# Altium schematic sheet stm32.SchDoc
size A4
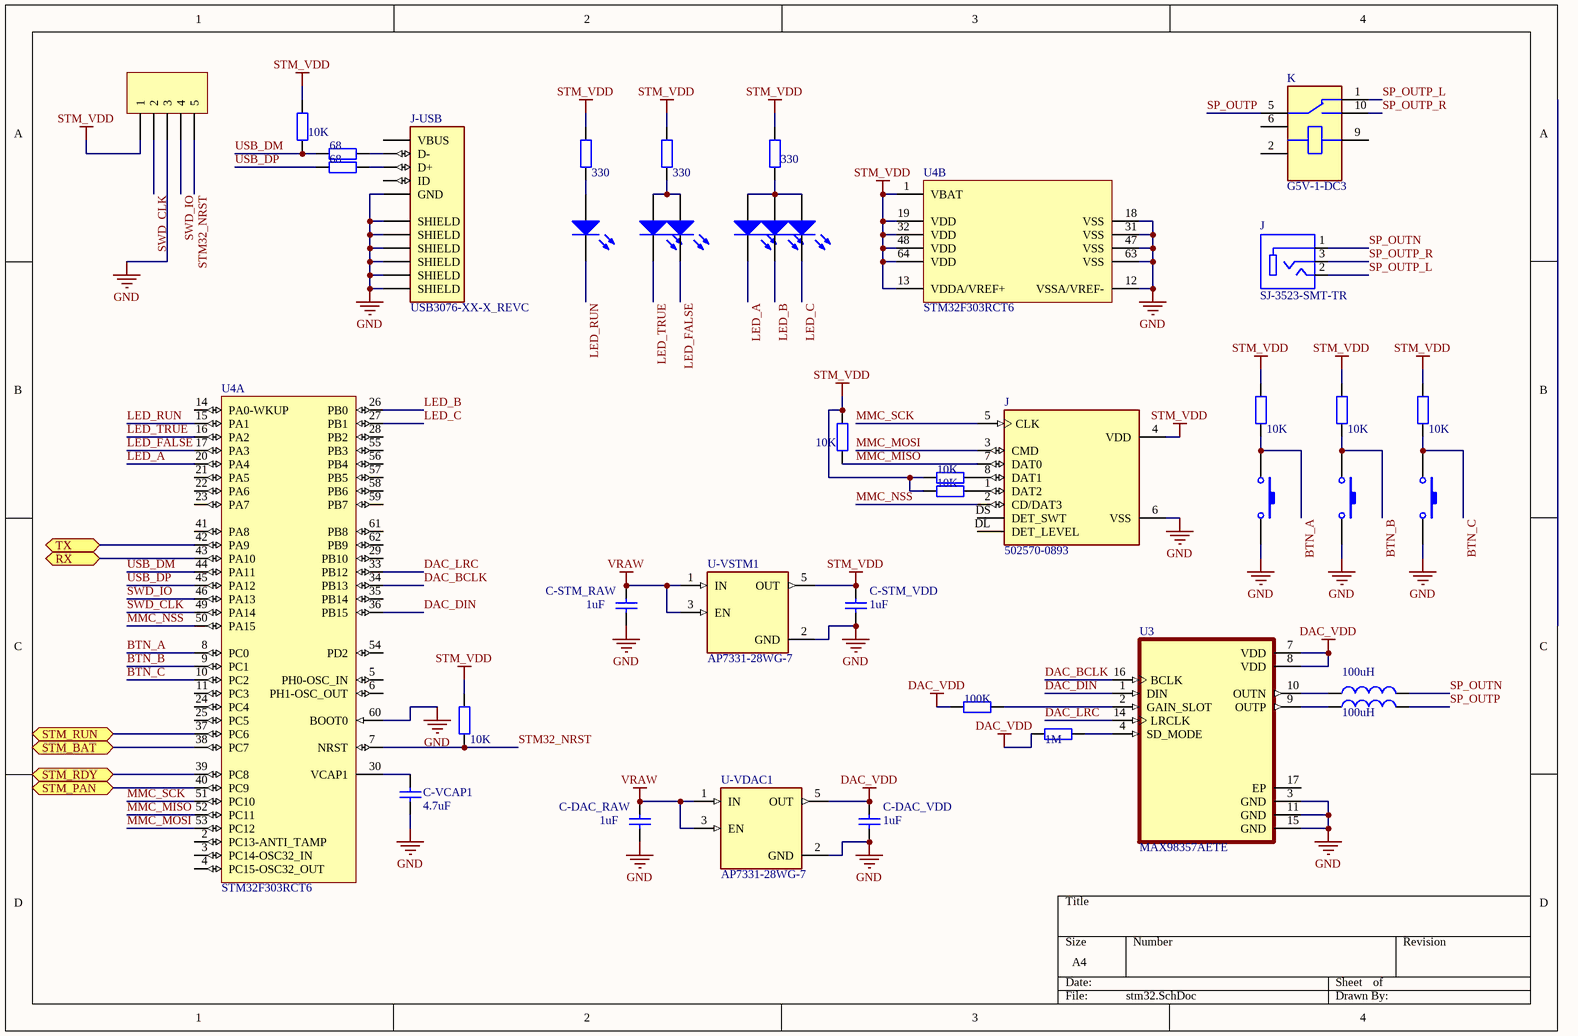
[diagram p0: stm32.SchDoc]

## Parts
(Parts that share a designator on the sheet are numbered #1, #2 ... from top to bottom, then left to right.)
C-DAC_RAW  value 1uF  [RAD-0.3]  (hidden comment: Cap)
C-DAC_VDD  value 1uF  [RAD-0.3]  (hidden comment: Cap)
C-STM_RAW  value 1uF  [RAD-0.3]  (hidden comment: Cap)
C-STM_VDD  value 1uF  [RAD-0.3]  (hidden comment: Cap)
C-VCAP1  value 4.7uF  [RAD-0.3]  (hidden comment: Cap)
D2  LED0  [LED-0]  (value not drawn)
D-BTN1  LED0  [LED-0]  (value not drawn)
D-BTN2  LED0  [LED-0]  (value not drawn)
D-BTN3  LED0  [LED-0]  (value not drawn)
D-LED-ANS1  LED0  [LED-0]  (value not drawn)
D-LED-ANS2  LED0  [LED-0]  (value not drawn)
J#1  SJ-3523-SMT-TR  [CUI_SJ-3523-SMT-TR]
J#2  502570-0893  [MOLEX_502570-0893]
J-USB  USB3076-XX-X_REVC  [GCT_USB3076-XX-X_REVC]
K  G5V-1-DC3  [RELAY_G5V-1-DC5]
L-DAC1  value 100uH  [0402-A]  (hidden comment: Inductor)
L-DAC2  value 100uH  [0402-A]  (hidden comment: Inductor)
P-STM32PROG  Header 5  [HDR1X5]  (value not drawn)
R-BTN1  value 10K  [AXIAL-0.4]  (hidden comment: Res2)
R-BTN2  value 10K  [AXIAL-0.4]  (hidden comment: Res2)
R-BTN3  value 10K  [AXIAL-0.4]  (hidden comment: Res2)
R-DAC1  value 100K  [AXIAL-0.4]  (hidden comment: Res2)
R-DAC3  value 1M  [AXIAL-0.4]  (hidden comment: Res2)
R-LED-ANS1  value 330  [AXIAL-0.4]  (hidden comment: Res2)
R-LED-BTN1  value 330  [AXIAL-0.4]  (hidden comment: Res2)
R-LED-RUN1  value 330  [AXIAL-0.4]  (hidden comment: Res2)
R-MMC1  value 10K  [AXIAL-0.4]  (hidden comment: Res2)
R-MMC2  value 10K  [AXIAL-0.4]  (hidden comment: Res2)
R-MMC3  value 10K  [AXIAL-0.4]  (hidden comment: Res2)
R-STM1  value 10K  [AXIAL-0.4]  (hidden comment: Res2)
R-USB1  value 10K  [AXIAL-0.4]  (hidden comment: Res2)
R-USB2  value 68  [AXIAL-0.4]  (hidden comment: Res2)
R-USB3  value 68  [AXIAL-0.4]  (hidden comment: Res2)
S-BTN1  SW-PB  [SPST-2]  (value not drawn)
S-BTN2  SW-PB  [SPST-2]  (value not drawn)
S-BTN3  SW-PB  [SPST-2]  (value not drawn)
U3  MAX98357AETE  [QFN50P300X300X80-17N]
U4  STM32F303RCT6  [STM-LQFP64_N]  (parts A,B of 2)
U-VDAC1  AP7331-28WG-7  [SOT95P285X145-5N]
U-VSTM1  AP7331-28WG-7  [SOT95P285X145-5N]

## Ports
RX, STM_BAT, STM_PAN, STM_RDY, STM_RUN, TX

## Nets
DAC_VDD: C-DAC_VDD.2 R-DAC1.1 R-DAC3.1 U3.7(VDD) U3.8(VDD) U-VDAC1.5(OUT)
GND: C-DAC_RAW.1 C-DAC_VDD.1 C-STM_RAW.1 C-STM_VDD.1 C-VCAP1.1 J#2.6(VSS) J-USB.5(GND) J-USB.6(SHIELD) J-USB.7(SHIELD) J-USB.8(SHIELD) J-USB.9(SHIELD) J-USB.10(SHIELD) J-USB.11(SHIELD) P-STM32PROG.3 S-BTN1.2 S-BTN2.2 S-BTN3.2 U3.3(GND) U3.11(GND) U3.15(GND) U4.12(VSSA/VREF-) U4.18(VSS) U4.31(VSS) U4.47(VSS) U4.60(BOOT0) U4.63(VSS) U-VDAC1.2(GND) U-VSTM1.2(GND)
STM_VDD: C-STM_VDD.2 J#2.4(VDD) P-STM32PROG.1 R-BTN1.1 R-BTN2.1 R-BTN3.1 R-LED-ANS1.2 R-LED-BTN1.2 R-LED-RUN1.2 R-MMC1.2 R-MMC2.1 R-MMC3.1 R-STM1.2 R-USB1.2 U4.1(VBAT) U4.13(VDDA/VREF+) U4.19(VDD) U4.32(VDD) U4.48(VDD) U4.64(VDD) U-VSTM1.5(OUT)
VRAW: C-DAC_RAW.2 C-STM_RAW.2 U-VDAC1.1(IN) U-VDAC1.3(EN) U-VSTM1.1(IN) U-VSTM1.3(EN)
BTN_A: R-BTN1.2 S-BTN1.1 U4.8(PC0)
BTN_B: R-BTN2.2 S-BTN2.1 U4.9(PC1)
BTN_C: R-BTN3.2 S-BTN3.1 U4.10(PC2)
DAC_BCLK: U3.16(BCLK) U4.34(PB13)
DAC_DIN: U3.1(DIN) U4.36(PB15)
DAC_LRC: U3.14(LRCLK) U4.33(PB12)
LED_A: D-BTN1.2(K) U4.20(PA4)
LED_B: D-BTN2.2(K) U4.26(PB0)
LED_C: D-BTN3.2(K) U4.27(PB1)
LED_FALSE: D-LED-ANS2.2(K) U4.17(PA3)
LED_RUN: D2.2(K) U4.15(PA1)
LED_TRUE: D-LED-ANS1.2(K) U4.16(PA2)
MMC_MISO: J#2.7(DAT0) R-MMC1.1 U4.52(PC11)
MMC_MOSI: J#2.3(CMD) U4.53(PC12)
MMC_NSS: J#2.2(CD/DAT3) U4.50(PA15)
MMC_SCK: J#2.5(CLK) U4.51(PC10)
RX: U4.43(PA10) ; port RX
SP_OUTN: J#1.1 L-DAC1.2
SP_OUTP: K.5(COM) L-DAC2.2
SP_OUTP_L: J#1.2 K.1(NC)
SP_OUTP_R: J#1.3 K.10(NO)
STM32_NRST: P-STM32PROG.5 R-STM1.1 U4.7(NRST)
STM_BAT: U4.38(PC7) ; port STM_BAT
STM_PAN: U4.40(PC9) ; port STM_PAN
STM_RDY: U4.39(PC8) ; port STM_RDY
STM_RUN: U4.37(PC6) ; port STM_RUN
SWD_CLK: P-STM32PROG.2 U4.49(PA14)
SWD_IO: P-STM32PROG.4 U4.46(PA13)
TX: U4.42(PA9) ; port TX
USB_DM: R-USB1.1 R-USB2.1 U4.44(PA11)
USB_DP: R-USB3.1 U4.45(PA12)
NetC-VCAP1_2: C-VCAP1.2 U4.30(VCAP1)
NetD2_1: D2.1(A) R-LED-RUN1.1
NetD-BTN1_1: D-BTN1.1(A) D-BTN2.1(A) D-BTN3.1(A) R-LED-BTN1.1
NetD-LED-ANS1_1: D-LED-ANS1.1(A) D-LED-ANS2.1(A) R-LED-ANS1.1
NetJ#2_1: J#2.1(DAT2) R-MMC3.2
NetJ#2_8: J#2.8(DAT1) R-MMC2.2
NetJ-USB_2: J-USB.2(D-) R-USB2.2
NetJ-USB_3: J-USB.3(D+) R-USB3.2
NetL-DAC1_1: L-DAC1.1 U3.10(OUTN)
NetL-DAC2_1: L-DAC2.1 U3.9(OUTP)
NetR-DAC1_2: R-DAC1.2 U3.2(GAIN_SLOT)
NetR-DAC3_2: R-DAC3.2 U3.4(SD_MODE)

Not connected (* = marked no-connect by the designer): J#2 DL(DET_LEVEL) DS(DET_SWT); J-USB 1(VBUS) 4(ID); K 2(C1) 6(COM) 9(C2); U3 17(EP); U4 2(PC13-ANTI_TAMP) 3(PC14-OSC32_IN) 4(PC15-OSC32_OUT) 5(PH0-OSC_IN) 6(PH1-OSC_OUT) 11(PC3) 14(PA0-WKUP) 21(PA5) 22(PA6) 23(PA7) 24(PC4) 25(PC5) 28(PB2) 29(PB10) 35(PB14) 41(PA8) 54(PD2) 55(PB3) 56(PB4) 57(PB5) 58(PB6) 59(PB7) 61(PB8) 62(PB9)

## Library data of the parts
C-DAC_RAW C-DAC_VDD C-STM_RAW C-STM_VDD C-VCAP1 = Cap: Capacitor; Published: 8-Jun-2000; LatestRevisionDate: 17-Jul-2002; LatestRevisionNote: Re-released for DXP Platform.; PackageReference: RAD-0.3; Publisher: Altium Limited; PackageDescription: Radial Cap, Thru-Hole; 2 Leads; 0.3 in Pin Spacing
D2 D-BTN1-D-BTN3 D-LED-ANS1 D-LED-ANS2 = LED0: Typical INFRARED GaAs LED; Published: 8-Jun-2000; LatestRevisionDate: 08-Jul-2005; LatestRevisionNote: Mech Layer 1 removed.; PackageReference: LED-0; Publisher: Altium Limited; PackageDescription: LED; 2 Leads
J#1 = SJ-3523-SMT-TR: 3.5 mm, Stereo, Right Angle, Surface Mount _SMT_, Audio Jack Connector; MF: CUI Devices; Package: LGA-10 STMicroelectronics; CUI_purchase_URL: https://www.cuidevices.com/product/interconnect/connectors/audio-connectors/jacks/sj-352x-smt-series?utm_source=snapeda.com&utm_medium=referral&utm_campaign=snapedaBOM; Value: *; Price: None; MP: SJ-3523-SMT-TR; Availability: Unavailable; SnapEDA_Link: https://www.snapeda.com/parts/SJ-3523-SMT-TR/CUI%20Devices/view-part/251570/?ref=snap
J#2 = 502570-0893: 10 _8 + 2_ Position Card Connector Secure Digital - microSDâ„¢ Surface Mount, Right Angle Gold; MF: Molex; Price: None; Package: None; Value: *; MP: 502570-0893; Availability: Unavailable; SnapEDA_Link: https://www.snapeda.com/parts/502570-0893/Molex/view-part/225170/?ref=snap
J-USB = USB3076-XX-X_REVC: USB - micro B USB 2.0 Receptacle Connector 5 Position Surface Mount, Right Angle; Through Hole; MP: USB3076-30-A; MF: Global Connector Technology; Availability: Unavailable; SnapEDA_Link: https://www.snapeda.com/parts/USB3076-30-A/Global%20Connector%20Technology/view-part/276912/?ref=snap; Package: None; Price: None; Value: *
K = G5V-1-DC5: General Purpose Relay SPDT _1 Form C_ Through Hole; MF: Omron Electronics; Package: None; Value: *; Price: None; MP: G5V-1-DC5; Availability: Unavailable; SnapEDA_Link: https://www.snapeda.com/parts/G5V-1-DC5/Omron%20Electronics%20Inc-EMC%20Div/view-part/125140/?ref=snap
L-DAC1 L-DAC2 = Inductor: Code_IEC: 1005; Published: 8-Jun-2000; LatestRevisionDate: 29-May-2009; LatestRevisionNote: IPC-7351 Footprint Added.; PackageReference: 0402-A; Publisher: Altium Limited; PackageDescription: Chip Inductor; Code_JEITA: 0402
P-STM32PROG = Header 5: Header, 5-Pin; LatestRevisionDate: 17-Jul-2002; LatestRevisionNote: Re-released for DXP Platform.; Publisher: Altium Limited
R-BTN1-R-BTN3 R-DAC1 R-DAC3 R-LED-ANS1 R-LED-BTN1 R-LED-RUN1 R-MMC1-R-MMC3 R-STM1 R-USB1-R-USB3 = Res2: Resistor; Published: 8-Jun-2000; LatestRevisionDate: 17-Jul-2002; LatestRevisionNote: Re-released for DXP Platform.; PackageReference: AXIAL-0.4; Publisher: Altium Limited; PackageDescription: Axial Device, Thru-Hole; 2 Leads; 0.4 in Pin Spacing
S-BTN1-S-BTN3 = SW-PB: Switch; Published: 24-Mar-1999; LatestRevisionDate: 17-Jul-2002; LatestRevisionNote: Re-released for DXP Platform.; PackageReference: SPST-2; Publisher: Altium Limited; PackageDescription: Switch; 2 Leads
U3 = MAX98357AETE: Audio Amp Speaker 1-CH Mono 3.2W Class-D 16-Pin TQFN EP T/R; MF: Maxim Integrated; SnapEDA_Link: https://www.snapeda.com/parts/MAX98357AETE/Maxim+Integrated/view-part/?ref=snap; MP: MAX98357AETE; Check_prices: https://www.snapeda.com/parts/MAX98357AETE/Maxim+Integrated/view-part/?ref=eda; Price: None; Purchase-URL: https://pricing.snapeda.com/search/part/MAX98357AETE/?ref=eda; Availability: In Stock; Value: *; Package: None
U4 = STM32F401RCT6: ARM Cortex-M4 32-bit MCU+FPU, 105 DMIPS, 256 kB Flash, 64 kB Internal RAM, 48 I/Os, 64-pin LQFP, -40 to 85 degC, Tray; Manufacturer: STMicroelectronics; FLASH Size (Prog) (kB): 256; I/Os (High Current): 48; Internal RAM Size (kB): 64; Operating Frequency(F) (Processor speed) (MHz): 84; Supply Voltage(Vcc) max (V): 3.6; Supply Voltage(Vcc) min (V): 1.8; DatasheetVersion: Rev. 1; PackageVersion: Rev. 4, 06/2013; PackageReference: LQFP64; PackageDescription: 64-Pin Low Profile Quad Flat Package, 10 x 10 mm Body, 0.5 mm Pitch; Supplier 1: Digi-Key; Supplier Part Number 1: 497-14047-ND; Supplier 2: Newark; Supplier Part Number 2: 19X6221; Supplier 3: Mouser; Supplier Part Number 3: 511-STM32F401RCT6; Core: ARM Cortex-M4; Packing: Tray; Mounting Technology: Surface Mount; PartNumber: STM32F401RCT6; ComponentLink1Description: Manufacturer URL; ComponentLink1URL: http://www.st.com/web/en/home.html; ComponentLink2Description: Datasheet; ComponentLink2URL: http://www.st.com/st-web-ui/static/active/en/resource/technical/document/data_brief/DM00071938.pdf; ComponentLink3Description: Package Specification; ComponentLink3URL: http://www.st.com/st-web-ui/static/active/en/resource/technical/document/datasheet/DM00037051.pdf
U-VDAC1 U-VSTM1 = AP7331-28WG-7: Linear Voltage Regulator IC 1 Output 300mA SOT-25; MF: Diodes Inc.; Price: None; Package: SOT-753 Diodes Inc.; MP: AP7331-28WG-7; Value: *; Availability: Unavailable; SnapEDA_Link: https://www.snapeda.com/parts/AP7331-28WG-7/Diodes%20Inc./view-part/622293/?ref=snap